# Altium schematic sheet ESP32-H2-AC-Power-monitoring_2025-10-18.schdoc
size 245 x 121 mm
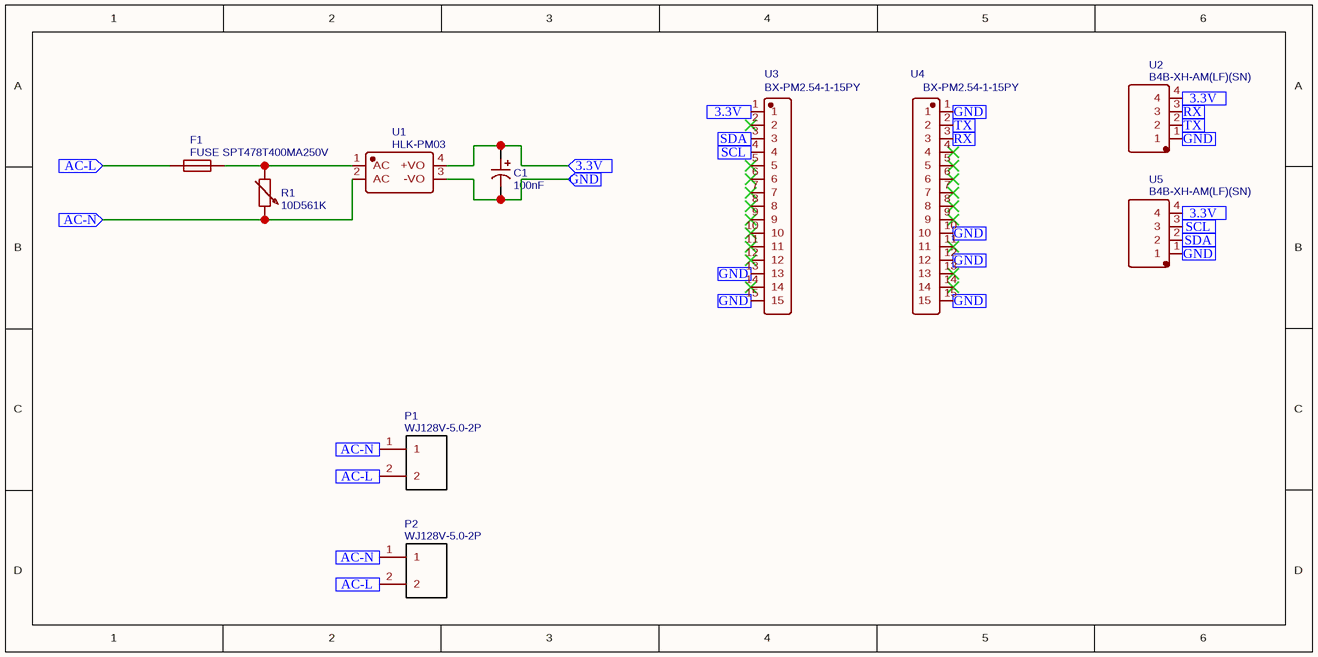
[diagram p0: ESP32-H2-AC-Power-monitoring_2025-10-18.schdoc]

## Parts
C1  100nF  [CAP-TH_BD5.0-P2.00-D0.5-FD]
F1  FUSE SPT478T400MA250V  [FUSE-TH_L8.4-W4.1-P5.08-D0.6]
P1  WJ128V-5.0-2P  [CONN-TH_2P-P5.00_WJ128V-5.0-2P]
P2  WJ128V-5.0-2P  [CONN-TH_2P-P5.00_WJ128V-5.0-2P]
R1  10D561K  [RES-TH_L13.0-W6.0-P7.50-D0.9-S6.00]
U1  HLK-PM03  [PWRM-TH_HLK-PM03]
U2  B4B-XH-AM(LF)(SN)  [CONN-TH_B4B-XH-AM-LF-SN]
U3  BX-PM2.54-1-15PY  [HDR-TH_15P-P2.54-V-F-1]
U4  BX-PM2.54-1-15PY  [HDR-TH_15P-P2.54-V-F-1]
U5  B4B-XH-AM(LF)(SN)  [CONN-TH_B4B-XH-AM-LF-SN]

## Ports
3.3V (in), AC-L (in), AC-N (in), GND (in), RX (in), SCL (in), SDA (in), TX (in)

## Nets
3.3V: C1.1 U1.4(+VO) U2.4 U3.1 U5.4 ; port 3.3V
AC-L: F1.2 P1.2 P2.2 ; port AC-L
AC-N: P1.1 P2.1 R1.2 U1.2(AC) ; port AC-N
GND: C1.2 U1.3(-VO) U2.1 U3.13 U3.15 U4.1 U4.10 U4.12 U4.15 U5.1 ; port GND
RX: U2.3 U4.3 ; port RX
SCL: U3.4 U5.3 ; port SCL
SDA: U3.3 U5.2 ; port SDA
TX: U2.2 U4.2 ; port TX
NetF1_1: F1.1 R1.1 U1.1(AC)

Not connected (* = marked no-connect by the designer): U3 2* 5* 6* 7* 8* 9* 10* 11* 12* 14*; U4 4* 5* 6* 7* 8* 9* 11* 13* 14*

## Library data of the parts
C1 = 100nF: Manufacturer: Nichicon(尼吉康); Manufacturer Part: UVR1H0R1MDD; Contributor: LCSC; nameAlias: Value; Supplier: LCSC; Supplier Part: C445190; JLCPCB Part Class: Extended Part; spicePre: C; spiceSymbolName: UVR1H0R1MDD
F1 = FUSE SPT478T400MA250V: Manufacturer: SET(赛尔特); Contributor: lcsc; Supplier: LCSC; Supplier Part: C2995764; Manufacturer Part: Fuse SPT478T400mA250V; JLCPCB Part Class: Extended Part; spicePre: F; spiceSymbolName: FUSE SPT478T400MA250V
P1 P2 = WJ128V-5.0-2P: Manufacturer: KANGNEX(康奈克斯电气); Supplier: LCSC; Manufacturer Part: WJ128V-5.0-2P; Supplier Part: C8269; JLCPCB Part Class: Extended Part; spicePre: P; spiceSymbolName: WJ128V-5.0-2P
R1 = 10D561K: Manufacturer: HEL(鸿志); Supplier: LCSC; Manufacturer Part: 10D561K; Supplier Part: C113236; JLCPCB Part Class: Extended Part; spicePre: R; spiceSymbolName: 10D561K
U1 = HLK-PM03: Manufacturer: HI-LINK(海凌科); Contributor: LCSC; Supplier: LCSC; Supplier Part: C209904; Manufacturer Part: HLK-PM03; JLCPCB Part Class: Extended Part; spicePre: U; spiceSymbolName: HLK-PM03
U2 U5 = B4B-XH-AM(LF)(SN): Manufacturer: JST; Contributor: LCSC; Supplier: LCSC; Supplier Part: C161871; Manufacturer Part: B4B-XH-AM(LF)(SN); JLCPCB Part Class: Extended Part; spicePre: U; spiceSymbolName: B4B-XH-AM(LF)(SN)
U3 U4 = BX-PM2.54-1-15PY: Manufacturer: Bossie(博锡); Contributor: lcsc; Supplier: LCSC; Supplier Part: C18078136; Manufacturer Part: BX-PM2.54-1-15PY; JLCPCB Part Class: Extended Part; spicePre: U; spiceSymbolName: BX-PM2.54-1-15PY